# EAGLE design INA219x2 FeatherWing (EAGLE 9.4.2)
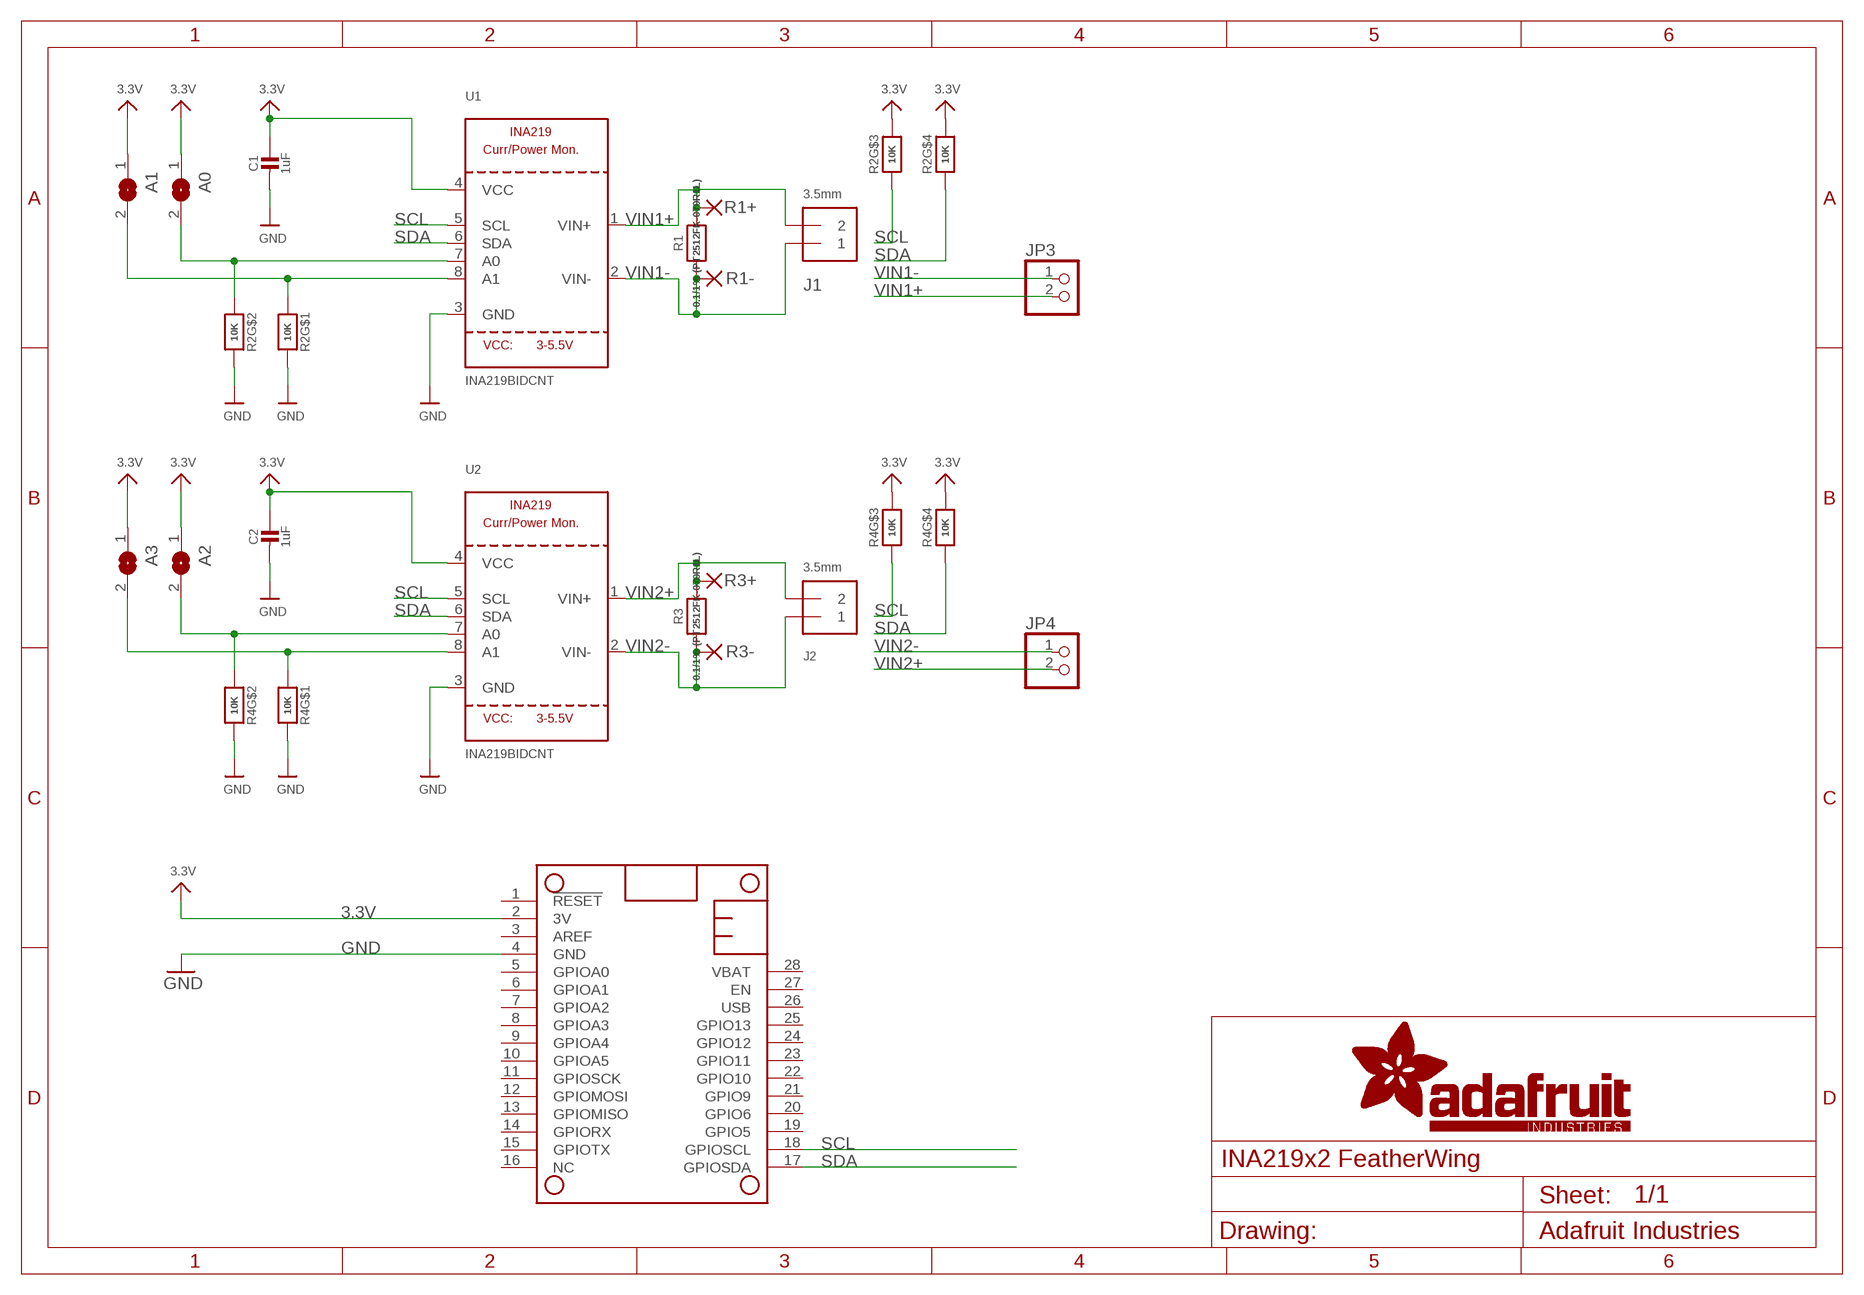
[diagram p0: schematic, sheet 1]

## Parts
A0  SOLDERJUMPERREFLOW_NOPASTE  [SOLDERJUMPER_REFLOW_NOPASTE]
A1  SOLDERJUMPERREFLOW_NOPASTE  [SOLDERJUMPER_REFLOW_NOPASTE]
A2  SOLDERJUMPERREFLOW_NOPASTE  [SOLDERJUMPER_REFLOW_NOPASTE]
A3  SOLDERJUMPERREFLOW_NOPASTE  [SOLDERJUMPER_REFLOW_NOPASTE]
C1  1uF  CAP_CERAMIC0805-NOOUTLINE  [0805-NO@1]
C2  1uF  CAP_CERAMIC0805-NOOUTLINE  [0805-NO@1]
J1  3.5mm  TERMBLOCK_1X2  [TERMBLOCK_1X2-3.5MM]
J2  3.5mm  TERMBLOCK_1X2  [TERMBLOCK_1X2-3.5MM]
JP3  HEADER-1X2ROUND  [1X02_ROUND]
JP4  HEADER-1X2ROUND  [1X02_ROUND]
MS1  FEATHERWING  [FEATHERWING]
R1  0.1/1% (PT2512FK-070R1L)  RESISTOR2512  [2512]
R1+  1,6/0,9  [1,6/0,9]
R1-  1,6/0,9  [1,6/0,9]
R2  10K  RESISTOR_4PACK  [RESPACK_4X0603]
R3  0.1/1% (PT2512FK-070R1L)  RESISTOR2512  [2512]
R3+  1,6/0,9  [1,6/0,9]
R3-  1,6/0,9  [1,6/0,9]
R4  10K  RESISTOR_4PACK  [RESPACK_4X0603]
U1  INA219BIDCNT  INA219  [SOT23-8]
U2  INA219BIDCNT  INA219  [SOT23-8]

## Nets
3.3V: A0.1 A1.1 A2.1 A3.1 C1.1 C2.1 MS1.2(3V) R2.5 R2.6 R4.5 R4.6 U1.4(VCC) U2.4(VCC)
GND: C1.2 C2.2 MS1.4(GND) R2.7 R2.8 R4.7 R4.8 U1.3(GND) U2.3(GND)
N$1: A1.2 R2.1 U1.8(A1)
N$2: A0.2 R2.2 U1.7(A0)
N$3: A3.2 R4.1 U2.8(A1)
N$4: A2.2 R4.2 U2.7(A0)
SCL: MS1.18(GPIOSCL) R2.3 R4.3 U1.5(SCL) U2.5(SCL)
SDA: MS1.17(GPIOSDA) R2.4 R4.4 U1.6(SDA) U2.6(SDA)
VIN1+: J1.2 JP3.2 R1+.1(P) R1.2 U1.1(VIN+)
VIN1-: J1.1 JP3.1 R1-.1(P) R1.1 U1.2(VIN-)
VIN2+: J2.2 JP4.2 R3+.1(P) R3.2 U2.1(VIN+)
VIN2-: J2.1 JP4.1 R3-.1(P) R3.1 U2.2(VIN-)
Unconnected: MS1.1(!RESET) MS1.3(AREF) MS1.5(GPIOA0) MS1.6(GPIOA1) MS1.7(GPIOA2) MS1.8(GPIOA3) MS1.9(GPIOA4) MS1.10(GPIOA5) MS1.11(GPIOSCK) MS1.12(GPIOMOSI) MS1.13(GPIOMISO) MS1.14(GPIORX) MS1.15(GPIOTX) MS1.16(NC) MS1.19(GPIO5) MS1.20(GPIO6) MS1.21(GPIO9) MS1.22(GPIO10) MS1.23(GPIO11) MS1.24(GPIO12) MS1.25(GPIO13) MS1.26(USB) MS1.27(EN) MS1.28(VBAT)

## Library data of the parts
A0 A1-A3 = microbuilder:SOLDERJUMPER: SMD Solder JUMPER Solder the two pads together to create a connection, or remove the solder to break it. REFLOW - Use this footprint for solder paste and reflow ovens. WAVE - Use this footprint for hand-soldering (larger pads). CLOSED - Has a trace between the two pads to ensure it is closed by default. The trace needs to be cut to disable the jumper, and can be closed again by creating a solder bridge between the two pads.
C1 C2 = microbuilder:CAP_CERAMIC: Ceramic Capacitors For new designs, use the packages preceded by an '_' character since they are more reliable: The following footprints should be used on most boards: _0402 - Standard footprint for regular board layouts _0603 - Standard footprint for regular board layouts _0805 - Standard footprint for regular board layouts _1206 - Standard footprint for regular board layouts For extremely tight-pitch boards where space is at a premium, the following 'micro-pitch' footprints can be used (smaller pads, no silkscreen outline, etc.): _0402MP - Micro-pitch footprint for very dense/compact boards _0603MP - Micro-pitch footprint for very dense/compact boards _0805MP - Micro-pitch footprint for very dense/compact boards _1206MP - Micro-pitch footprint for very dense/compact boards
J1 J2 = microbuilder:TERMBLOCK_1X2: 3.5mm Terminal block http://www.ladyada.net/library/pcb/eaglelibrary.html
JP3 JP4 = microbuilder:HEADER-1X2: PIN HEADER
MS1 = microbuilder:FEATHERWING
R1 R3 = microbuilder:RESISTOR: Resistors For new designs, use the packages preceded by an '_' character since they are more reliable: The following footprints should be used on most boards: _0402 - Standard footprint for regular board layouts _0603 - Standard footprint for regular board layouts _0805 - Standard footprint for regular board layouts _1206 - Standard footprint for regular board layouts For extremely tight-pitch boards where space is at a premium, the following 'micro-pitch' footprints can be used (smaller pads, no silkscreen outline, etc.): _0402MP - Micro-pitch footprint for very dense/compact boards _0603MP - Micro-pitch footprint for very dense/compact boards _0805MP - Micro-pitch footprint for very dense/compact boards _1206MP - Micro-pitch footprint for very dense/compact boards
R1+ R1- R3+ R3- = wirepad:1,6/0,9: THROUGH-HOLE PAD
R2 R4 = microbuilder:RESISTOR_4PACK: Resistor Packs (4 resistors) 4 x 0603 10K 1/16W - Digikey: YC164J-10KCT-ND
U1 U2 = microbuilder:INA219: INA219 - I2C Current/Power Monitor Voltage Range: 0-26V Accuracy: 0.5% Temperature: -40°C - 125°C

## Board
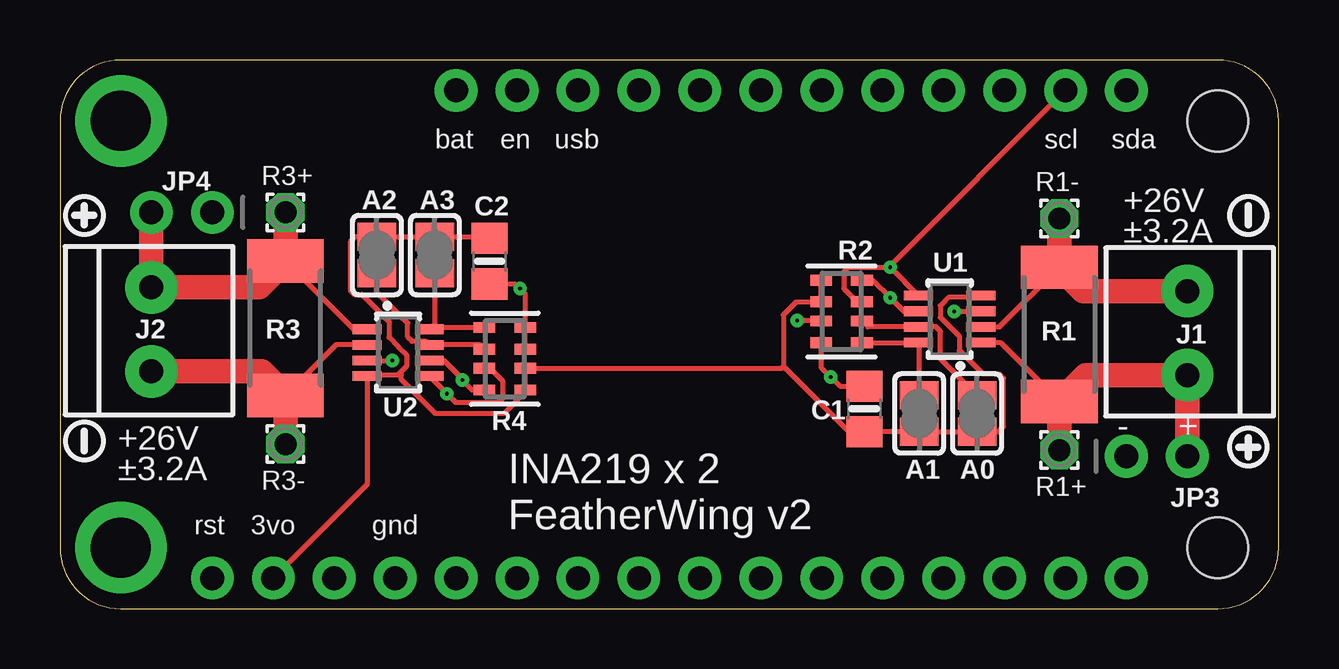
[diagram p1: board, top side]
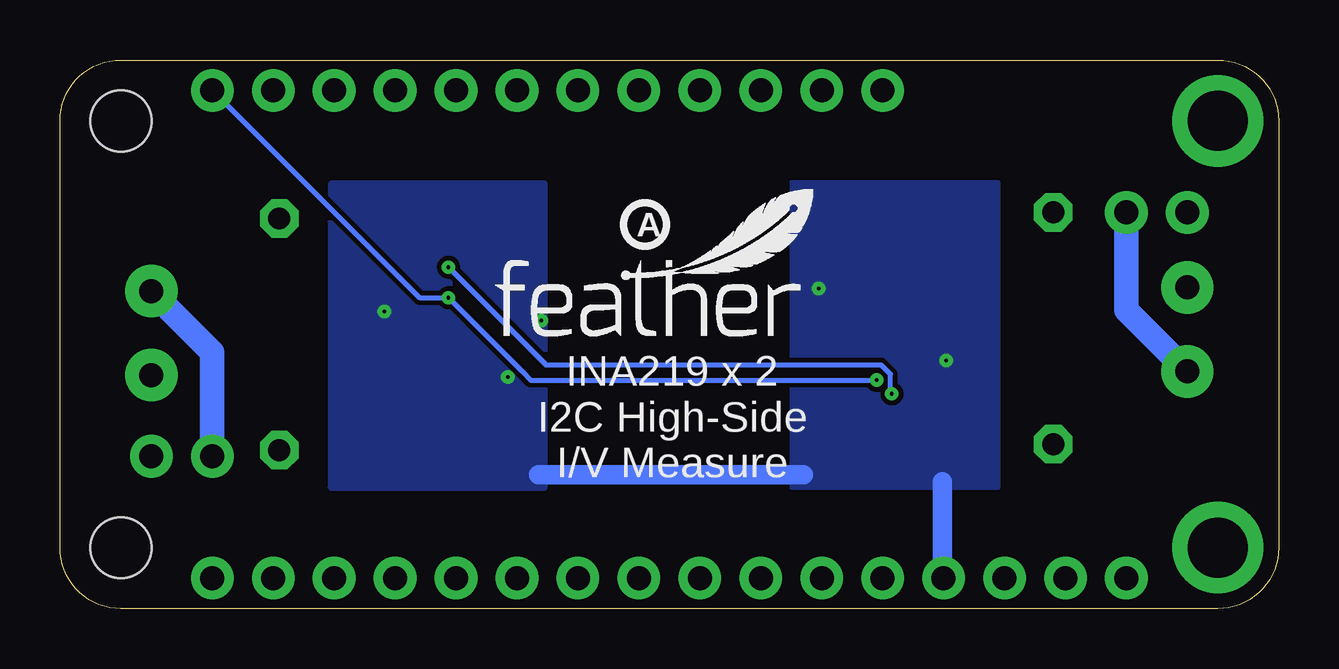
[diagram p2: board, bottom side, seen from below]

Size 50.8 x 22.86 mm. Coordinates in mm from the lower left corner, seen from the top.
Copper layers (1*16): Top 0.035mm / dielectric 1.5mm / Bottom 0.035mm
Design rules "adafruit *": minimum track width 8mil, minimum drill 15.5mil, track to track 8mil, track to pad 8mil, pad to pad 8mil, via to via 8mil, smd to smd 8mil, copper to edge 10mil, drill to drill 8mil, minimum pad ring 10mil, minimum via ring 8mil, stop-mask expansion 2mil, vias tented up to drill 20mil, thermal gap 10mil

### Footprints (pad centres in the part's own frame; a part is rotated, then mirrored left to right if it is on the bottom)
SOLDERJUMPER_REFLOW_NOPASTE = smd 1.168 x 1.6: 1 -0.762,0; 2 0.762,0
0805-NO@1 = smd 1.3 x 1.5: 1 -0.95,0; 2 0.95,0
TERMBLOCK_1X2-3.5MM = drill 1 pad 2.184: 1 1.8,0; 2 -1.7,0
1X02_ROUND = drill 1 pad 1.778: 1 -1.27,0; 2 1.27,0
FEATHERWING = drill 1 pad 1.778: 1 6.35,1.27; 2 8.89,1.27; 3 11.43,1.27; 4 13.97,1.27; 5 16.51,1.27; 6 19.05,1.27; 7 21.59,1.27; 8 24.13,1.27; 9 26.67,1.27; 10 29.21,1.27; 11 31.75,1.27; 12 34.29,1.27; 13 36.83,1.27; 14 39.37,1.27; 15 41.91,1.27; 16 44.45,1.27; 17 44.45,21.59; 18 41.91,21.59; 19 39.37,21.59; 20 36.83,21.59; 21 34.29,21.59; 22 31.75,21.59; 23 29.21,21.59; 24 26.67,21.59; 25 24.13,21.59; 26 21.59,21.59; 27 19.05,21.59; 28 16.51,21.59 | drill 2.5 pad 3.81: P$1 2.54,20.32; P$2 2.54,2.54 | hole 2.54: 48.26,20.32; 48.26,2.54
2512 = smd 1.8 x 3.2: 1 -2.8,0; 2 2.8,0
1,6/0,9 = drill 0.914 pad 1.6 octagon: 1 0,0
RESPACK_4X0603 = smd 0.45 x 0.9: 1 -1.3,-0.85; 2 -0.4,-0.85; 3 0.4,-0.85; 4 1.3,-0.85; 5 1.3,0.85; 6 0.4,0.85; 7 -0.4,0.85; 8 -1.3,0.85
SOT23-8 = smd 0.4 x 1.2: 1 -0.975,-1.3; 2 -0.325,-1.3; 3 0.325,-1.3; 4 0.975,-1.3; 5 0.975,1.3; 6 0.325,1.3; 7 -0.325,1.3; 8 -0.975,1.3

### Placement (x,y rotation side)
A0  38.23,8.13 90 top
A1  35.81,8.13 90 top
A2  13.21,14.73 270 top
A3  15.62,14.73 270 top
C1  33.53,8.32 90 top
C2  17.91,14.48 270 top
J1  46.99,11.43 90 top
J2  3.81,11.68 270 top
JP3  45.72,6.35 0 top
JP4  5.08,16.51 180 top
MS1  0,0 0 top
R1  41.66,11.43 270 top
R1+  41.66,6.6 0 top
R1-  41.66,16.26 0 top
R2  32.58,12.38 90 top
R3  9.4,11.68 90 top
R3+  9.4,16.51 0 top
R3-  9.4,6.86 0 top
R4  18.54,10.41 270 top
U1  37.08,12.06 90 top
U2  14.1,10.67 270 top
U$12  [SYMBOL_PLUS]  49.53,6.73 0 top
U$13  [SYMBOL_MINUS]  49.53,16.38 90 top
U$14  [SYMBOL_PLUS]  1.02,16.38 0 top
U$15  [FEATHERLOGO_SMALL]  32.77,11.3 0 bottom
U$16  [SYMBOL_MINUS]  1.02,6.99 90 top
U$17  [PCBFEAT-REV-040]  26.42,16 0 bottom

### Tracks (layer width: path | path; a pad name or v marks a point on that pad's centre or on a via)
3.3V
  Top 0.203: R2.5 R2.6 30.69,12.78 30.15,12.24 30.15,10.11 30.16,10.1 | C2.1 17.84,15.49 A3.1 A2.1 12.32,15.49 12.1,15.28 12.1,13.26 12.28,13.08 12.59,13.08 13.72,11.96 13.72,11.3 14.1,10.92 14.44,10.58 14.44,10.1 14.16,9.82 | 14.16,9.82 14.1,9.75 12.86,9.75 U2.4 12.8,5.18 MS1.2 | U1.4 38.31,12.97 37.03,12.97 36.69,12.62 36.69,12.14 37.48,11.35 37.48,10.76 38.46,9.78 39.15,9.78 39.33,9.6 39.33,7.58 39.12,7.37 A0.1 A1.1 C1.1 33.53,7.32 32.92,7.32 32.93,7.33 30.16,10.1 | 30.16,10.1 30.08,10.01 R4.6 R4.5 19.39,9.03 18.49,8.13 15.65,8.13 14.22,9.55 14.22,9.75 14.16,9.82
GND  (via drill 0.15)
  Top 0.203: R4.7 R4.8 19.39,13.12 v19.18,13.34 18.98,13.53 C2.2 | C1.2 32.51,9.27 v32.13,9.65 31.73,10.06 R2.8 31.75,11.06 31.75,11.96 R2.7 31.71,12 v30.73,12 | v37.27,12.38 U1.3 | U2.3 v13.86,10.34
  Bottom 0.203: 14.02,1.32 MS1.4 13.97,5.23 14.02,5.28
  Bottom 0.813: 14.02,5.28 14.02,1.32 | 30.86,5.59 19.81,5.59
  pour Bottom: 30.61,17.72 30.61,5.02 39.5,5.02 39.5,17.72
  pour Bottom: 20.32,17.78 11.68,17.78 11.68,5.02 20.32,5.02
N$1
  Top 0.203: R2.1 U1.8 35.81,11.06 A1.2
N$2
  Top 0.203: R2.2 33.67,11.74 U1.7 36.51,11.75 36.7,11.55 36.7,10.41 A0.2
N$3
  Top 0.203: A3.2 15.62,11.87 U2.8 15.47,11.71 R4.1
N$4
  Top 0.203: A2.2 13.21,13.18 14.49,11.9 14.49,11.32 14.67,11.14 15.25,11.14 U2.7 17.51,10.99 R4.2
SCL  (via drill 0.15)
  Top 0.203: R4.3 17.93,10.01 18.45,9.49 18.45,8.76 18.27,8.58 16.51,8.58 16.13,8.96 | U2.5 16.13,8.96 | 16.13,8.96 v16.13,8.95 | MS1.18 34.61,14.29 v34.61,14.22 | v34.61,14.22 U1.5 | v34.61,14.22 34.6,14.21 32.85,14.21 32.67,14.03 32.67,13.33 33.22,12.78 R2.3
  Bottom 0.203: v16.13,8.95 16.18,9 16.18,9.77 16.57,10.16 30.54,10.16 v34.61,14.22
SDA  (via drill 0.15)
  Top 0.203: R4.4 17.18,9.11 v16.76,9.53 16.76,9.58 16,10.34 U2.6 | R2.4 33.89,13.68 33.89,13.67 v34.61,12.95 35.17,12.39 U1.6
  Bottom 0.203: v16.76,9.53 31.18,9.53 31.55,9.89 31.89,10.24 v34.61,12.95 35.81,12.95 MS1.17
VIN1+
  Top 0.203: R1.2 39.2,11.09 U1.1
  Top 1.016: JP3.2 J1.2 42.75,9.73 R1.2 R1+.1
VIN1-
  Top 0.203: U1.2 39.17,11.74 R1.1
  Top 1.016: R1-.1 R1.1 42.66,13.23 J1.1
  Bottom 1.016: J1.1 44.45,10.69 JP3.1
VIN2+
  Top 0.203: R3.2 12.24,11.64 U2.1
  Top 1.016: JP4.2 J2.2 8.3,13.38 R3.2 R3+.1
VIN2-
  Top 0.203: U2.2 11.51,10.99 R3.1
  Top 1.016: R3-.1 R3.1 8.4,9.88 J2.1
  Bottom 1.016: JP4.1 6.35,12.42 J2.1

### Text on the board
tPlace: bat | en | usb | scl | sda | +26V | ±3.2A | +26V | - | + | ±3.2A | rst | 3vo | gnd | INA219 x 2 / FeatherWing v2
bPlace: INA219 x 2 / I2C High-Side / I/V Measure